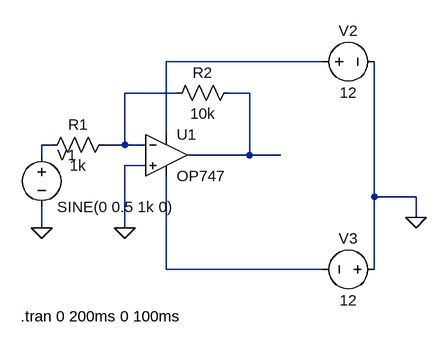
[diagram p0: schematic Inverting_Amplifier.asc]
Inverting_Amplifier.asc, the LTspice schematic file:
Version 4.1
SHEET 1 880 680
WIRE 368 0 128 0
WIRE 144 48 64 48
WIRE 256 48 224 48
WIRE 128 112 128 0
WIRE -48 128 -64 128
WIRE 64 128 64 48
WIRE 64 128 32 128
WIRE 96 128 64 128
WIRE -64 144 -64 128
WIRE 256 144 256 48
WIRE 256 144 160 144
WIRE 304 144 256 144
WIRE 96 160 64 160
WIRE 448 208 448 0
WIRE 512 208 448 208
WIRE 512 240 512 208
WIRE -64 256 -64 224
WIRE 64 256 64 160
WIRE 128 320 128 176
WIRE 368 320 128 320
WIRE 448 320 448 208
FLAG -64 256 0
FLAG 64 256 0
FLAG 512 240 0
SYMBOL OpAmps\\OP747 128 80 R0
SYMATTR InstName U1
SYMBOL voltage -64 128 R0
WINDOW 123 0 0 Left 0
WINDOW 39 0 0 Left 0
SYMATTR InstName V1
SYMATTR Value SINE(0 0.5 1k 0)
SYMBOL res 48 112 R90
WINDOW 0 0 56 VBottom 2
WINDOW 3 32 56 VTop 2
SYMATTR InstName R1
SYMATTR Value 1k
SYMBOL res 240 32 R90
WINDOW 0 0 56 VBottom 2
WINDOW 3 32 56 VTop 2
SYMATTR InstName R2
SYMATTR Value 10k
SYMBOL voltage 352 0 R270
WINDOW 0 32 56 VTop 2
WINDOW 3 -32 56 VBottom 2
WINDOW 123 0 0 Left 0
WINDOW 39 0 0 Left 0
SYMATTR InstName V2
SYMATTR Value 12
SYMBOL voltage 464 320 R90
WINDOW 0 -32 56 VBottom 2
WINDOW 3 32 56 VTop 2
WINDOW 123 0 0 Left 0
WINDOW 39 0 0 Left 0
SYMATTR InstName V3
SYMATTR Value 12
TEXT -96 392 Left 2 !.tran 0 200ms 0 100ms

The netlist it stands for:
* Inverting_Amplifier.asc
X§U1 0 N002 N001 N005 N003 OP747  ; pins In+ In- V+ V- OUT
V1 N004 0 SINE(0 0.5 1k 0)
R1 N002 N004 1k
R2 N003 N002 10k
V2 N001 0 12
V3 0 N005 12
.tran 0 200ms 0 100ms
.backanno
.end